# Altium schematic sheet pca10156_sheet8_switches.SchDoc: =BoardTitle+' - QSPI Switching'
size A3; Organization: Nordic Semiconductor; DocumentNumber: 8; SheetNumber: 8; SheetTotal: 8; CompanyName: Nordic Semiconductor; DocumentSize: A4
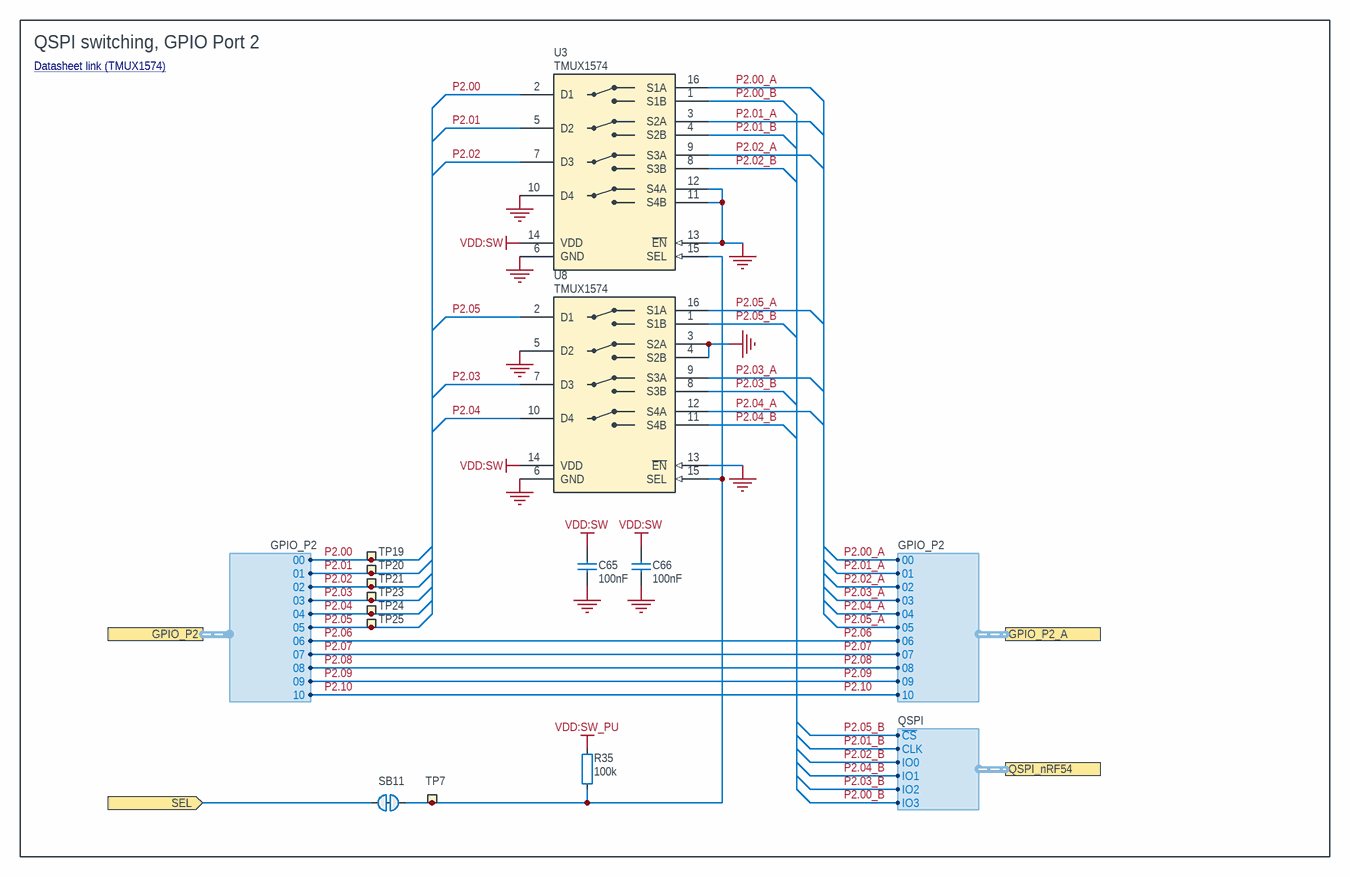
[diagram p0: pca10156_sheet8_switches.SchDoc]

## Parts
C65  100nF  [CAPC0603X03L_C]
C66  100nF  [CAPC0603X03L_C]
R35  100k  [RESC0603X03L_C]
SB11  Solderbridge  [Solderbridge_Shorted]  (value not drawn)  (net tie, no BOM)
TP7  Ø0.7mm,SMD  [TP_SMD_D0.7mm]  (value not drawn)  (no BOM)
TP19  Ø0.7mm,SMD  [TP_SMD_D0.7mm]  (value not drawn)  (no BOM)
TP20  Ø0.7mm,SMD  [TP_SMD_D0.7mm]  (value not drawn)  (no BOM)
TP21  Ø0.7mm,SMD  [TP_SMD_D0.7mm]  (value not drawn)  (no BOM)
TP23  Ø0.7mm,SMD  [TP_SMD_D0.7mm]  (value not drawn)  (no BOM)
TP24  Ø0.7mm,SMD  [TP_SMD_D0.7mm]  (value not drawn)  (no BOM)
TP25  Ø0.7mm,SMD  [TP_SMD_D0.7mm]  (value not drawn)  (no BOM)
U3  TMUX1574  [XQFN40P180X260X50-16N]
U8  TMUX1574  [XQFN40P180X260X50-16N]

## Ports
GPIO_P2 (harness GPIO_P2), GPIO_P2_A (harness GPIO_P2), QSPI_nRF54 (harness QSPI), SEL (in)

## Harnesses
GPIO_P2: 00, 01, 02, 03, 04, 05, 06, 07, 08, 09, 10
QSPI: ~{CS}, IO0, CLK, IO1, IO2, IO3

## Nets
GND: C65.2 C66.2 U3.6(GND) U3.10(D4) U3.11(S4B) U3.12(S4A) U3.13(~{EN}) U8.3(S2A) U8.4(S2B) U8.5(D2) U8.6(GND) U8.13(~{EN})
VDD:SW: C65.1 C66.1 U3.14(VDD) U8.14(VDD)
VDD:SW_PU: R35.2
P2.00: TP19.1 U3.2(D1) ; port GPIO_P2.00
P2.00_A: U3.16(S1A) ; port GPIO_P2_A.00
P2.00_B: U3.1(S1B) ; port QSPI_nRF54.IO3
P2.01: TP20.1 U3.5(D2) ; port GPIO_P2.01
P2.01_A: U3.3(S2A) ; port GPIO_P2_A.01
P2.01_B: U3.4(S2B) ; port QSPI_nRF54.CLK
P2.02: TP21.1 U3.7(D3) ; port GPIO_P2.02
P2.02_A: U3.9(S3A) ; port GPIO_P2_A.02
P2.02_B: U3.8(S3B) ; port QSPI_nRF54.IO0
P2.03: TP23.1 U8.7(D3) ; port GPIO_P2.03
P2.03_A: U8.9(S3A) ; port GPIO_P2_A.03
P2.03_B: U8.8(S3B) ; port QSPI_nRF54.IO2
P2.04: TP24.1 U8.10(D4) ; port GPIO_P2.04
P2.04_A: U8.12(S4A) ; port GPIO_P2_A.04
P2.04_B: U8.11(S4B) ; port QSPI_nRF54.IO1
P2.05: TP25.1 U8.2(D1) ; port GPIO_P2.05
P2.05_A: U8.16(S1A) ; port GPIO_P2_A.05
P2.05_B: U8.1(S1B) ; port QSPI_nRF54.~{CS}
P2.06: port GPIO_P2.06, port GPIO_P2_A.06
P2.07: port GPIO_P2.07, port GPIO_P2_A.07
P2.08: port GPIO_P2.08, port GPIO_P2_A.08
P2.09: port GPIO_P2.09, port GPIO_P2_A.09
P2.10: port GPIO_P2.10, port GPIO_P2_A.10
SEL: SB11.1 ; port SEL
NetR35_1: R35.1 SB11.2 TP7.1 U3.15(SEL) U8.15(SEL)

## Notes on the sheet
- QSPI switching, GPIO Port 2
- Datasheet link (TMUX1574) <https://www.ti.com/lit/ds/symlink/tmux1574.pdf?ts=1730869182960>
- Title
- Size
- Date:
- File:
- A3
- PCB Assembly Number
- Sheet
- Drawn By:
- Revision
- of
- Classification:

## Library data of the parts
C65 C66 = C0201-100n: Capacitor, X5R, ±10%; Manufacturer: N.A.; Part number IPS: 00000001248, 00000002505; Part number Norautron: 262071862; Part number NEMS: 100200078; Pad Count: 2; Note: 16V; Component Status: Active; Part Number: C0201-100n; LatestRevisionDate: 2017-11-09; Published: 2014-11-13; Value: 100nF; Footprint Doc: 0201; Component Class: Capacitors; PartId: 100200078; Author: rsk; Manufacturer Part Number: N.A.; ComponentLink1URL: N.A.; ComponentLink1Description: Datasheet; ComponentLink2URL: N.A.; ComponentLink2Description: Supplier link; HelpURL: N.A.; Supplier 1: N.A.; Supplier Part Number 1: N.A.; Supplier 2: N.A.; Supplier Part Number 2: N.A.; Artikkelnr Noca: N.A.
R35 = R0201-100k: Resistor, ±1%, 0.05W; Manufacturer: N.A.; Part number IPS: 00000001419; Part number Norautron: 26108487; Part number NEMS: 100100080; Note: Chip Res 1%; Pad Count: 2; Component Status: Active; Part Number: R0201-100k; Manufacturer Part Number: N.A.; ComponentLink1URL: N.A.; ComponentLink1Description: Datasheet; ComponentLink2URL: N.A.; ComponentLink2Description: Supplier link; HelpURL: N.A.; Footprint Doc: 0201; LatestRevisionDate: 2014-11-13; Published: 2014-11-13; Value: 100k; Artikkelnr Noca: N.A.; Supplier 1: N.A.; Supplier Part Number 1: N.A.; Supplier 2: N.A.; Supplier Part Number 2: N.A.; Component Class: Resistors; PartId: 100100080; Author: rsk
SB11 = Solderbridge Shorted: Shorted Solderbridge; Manufacturer: N.A.; Part number NEMS: 100500459; Pad Count: 2; Component Status: Active; System: Connector; Part Number: Solderbridge Shorted; Manufacturer Part Number: N.A.; LatestRevisionDate: 2012-08-07; Published: 2012-08-07; Value: Solderbridge; Note: N.A.; Artikkelnr Noca: N.A.; Footprint Doc: Solderbridge_Shorted; Part number IPS: N.A.; ComponentLink1URL: N.A.; ComponentLink1Description: Datasheet; ComponentLink2URL: N.A.; ComponentLink2Description: Supplier link; HelpURL: N.A.; Supplier 1: N.A.; Supplier Part Number 1: N.A.; Supplier 2: N.A.; Supplier Part Number 2: N.A.; Component Class: Connectors; PartId: 100500459; Author: rsk; Part number Norautron: N.A.
TP7 TP19-TP21 TP23-TP25 = TP_SMD_Ø0.7MM: 0.7mm circular SMD testpad; Manufacturer: Nordic Semiconductor; Manufacturer Part Number: N.A.; Part number NEMS: 100500474; Component Status: Active; Pad Count: 1; Part Number: TP_SMD_Ø0.7MM; PartId: 100500474; Component Class: Connectors; Author: rsk; ComponentLink1URL: N.A.; ComponentLink1Description: Datasheet; ComponentLink2URL: N.A.; ComponentLink2Description: Supplier link; HelpURL: N.A.; LatestRevisionDate: 2021-03-05; Published: 2017-12-14; Footprint Doc: TP_SMD_Ø0.7mm; Value: Ø0.7mm,SMD; Note: N.A.; Supplier 1: N.A.; Supplier Part Number 1: N.A.; Supplier 2: N.A.; Supplier Part Number 2: N.A.; Artikkelnr Noca: N.A.; Part number IPS: N.A.; Part number Norautron: N.A.
U3 U8 = TMUX1574: Low-Capacitance, 2:1 (SPDT) 4-Channel, analog switch; Manufacturer: Texas Instruments; Manufacturer Part Number: TMUX1574RSVR; Part number NEMS: 101900850; Component Status: Active; Pad Count: 16; Note: N.A.; Part Number: TMUX1574; Component Class: Misc_ICs; Author: stl1; ComponentLink1URL: https://www.ti.com/lit/ds/symlink/tmux1574.pdf?ts=1730869182960; ComponentLink1Description: Datasheet; ComponentLink2URL: N.A.; ComponentLink2Description: Supplier link; HelpURL: https://www.ti.com/lit/ds/symlink/tmux1574.pdf?ts=1730869182960; LatestRevisionDate: 2024-11-20; Published: 2024-11-20; Footprint Doc: UFQFN-16; Value: TMUX1574; Supplier 1: Digi-Key; Supplier Part Number 1: 296-53445-2-ND; Supplier 2: Mouser; Supplier Part Number 2: 595-TMUX1574RSVR; Artikkelnr Noca: N.A.; Part number IPS: N.A.; Part number Norautron: N.A.; PartId: 101900850